# Altium schematic sheet XMC4800-ECAT-P1.SchDoc: XMC4800-ECAT-P1
size A4
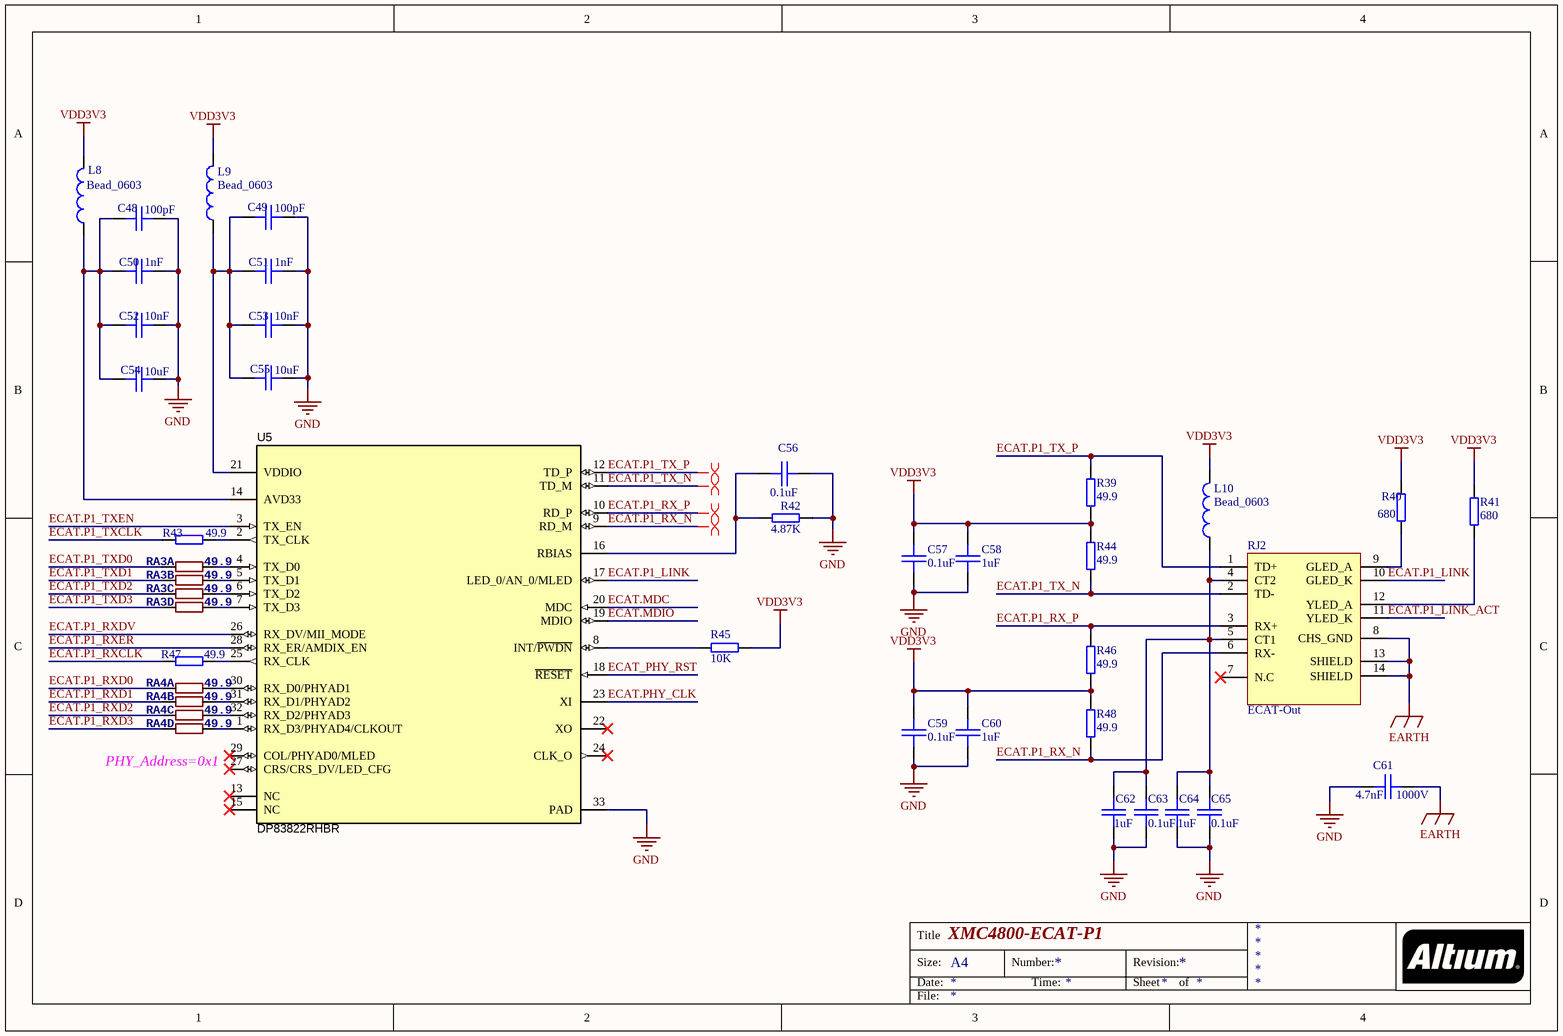
[diagram p0: XMC4800-ECAT-P1.SchDoc]

## Parts
C48  100pF  [CAP-0603]
C49  100pF  [CAP-0603]
C50  1nF  [CAP-0603]
C51  1nF  [CAP-0603]
C52  10nF  [CAP-0603]
C53  10nF  [CAP-0603]
C54  10uF  [CAP-0603]
C55  10uF  [CAP-0603]
C56  0.1uF  [CAP-0603]
C57  0.1uF  [CAP-0603]
C58  1uF  [CAP-0603]
C59  0.1uF  [CAP-0603]
C60  1uF  [CAP-0603]
C61  4.7nF  voltage: 1000V  [CAP-1206]
C62  1uF  [CAP-0603]
C63  0.1uF  [CAP-0603]
C64  1uF  [CAP-0603]
C65  0.1uF  [CAP-0603]
L8  Bead_0603  [L-0603]
L9  Bead_0603  [L-0603]
L10  Bead_0603  [L-0603]
R39  49.9  [RES-0603]
R40  680  [RES-0603]
R41  680  [RES-0603]
R42  4.87K  [RES-0603]
R43  49.9  [RES-0603]
R44  49.9  [RES-0603]
R45  10K  [RES-0603]
R46  49.9  [RES-0603]
R47  49.9  [RES-0603]
R48  49.9  [RES-0603]
RA3  49.9  [LC-0603_Rx4]  (parts A,B,C,D of 4)
RA4  49.9  [LC-0603_Rx4]  (parts A,B,C,D of 4)
RJ2  ECAT-Out  [HR911105A]
U5  DP83822RHBR  [RHB0032B]

## Nets
EARTH: C61.2 RJ2.8(CHS_GND) RJ2.13(SHIELD) RJ2.14(SHIELD)
GND: C48.2 C49.2 C50.1 C51.1 C52.1 C53.1 C54.1 C55.1 C56.2 C57.2 C58.2 C59.2 C60.2 C61.1 C62.2 C63.2 C64.2 C65.2 R42.2 U5.33(PAD)
VDD3V3: C57.1 C58.1 C59.1 C60.1 L8.2 L9.2 L10.2 R39.1 R40.2 R41.1 R44.2 R45.2 R46.1 R48.2
ECAT.MDC: U5.20(MDC)
ECAT.MDIO: U5.19(MDIO)
ECAT.P1_LINK: RJ2.10(GLED_K) U5.17(LED_0/AN_0/MLED)
ECAT.P1_LINK_ACT: RJ2.11(YLED_K)
ECAT.P1_RX_N: R48.1 RJ2.6(RX-) U5.9(RD_M)
ECAT.P1_RX_P: R46.2 RJ2.3(RX+) U5.10(RD_P)
ECAT.P1_RXCLK: R47.1
ECAT.P1_RXD0: RA4.1
ECAT.P1_RXD1: RA4.2
ECAT.P1_RXD2: RA4.3
ECAT.P1_RXD3: RA4.4
ECAT.P1_RXDV: U5.26(RX_DV/MII_MODE)
ECAT.P1_RXER: U5.28(RX_ER/AMDIX_EN)
ECAT.P1_TX_N: R44.1 RJ2.2(TD-) U5.11(TD_M)
ECAT.P1_TX_P: R39.2 RJ2.1(TD+) U5.12(TD_P)
ECAT.P1_TXCLK: R43.1
ECAT.P1_TXD0: RA3.1
ECAT.P1_TXD1: RA3.2
ECAT.P1_TXD2: RA3.3
ECAT.P1_TXD3: RA3.4
ECAT.P1_TXEN: U5.3(TX_EN)
ECAT.PHY_CLK: U5.23(XI)
ECAT_PHY_RST: U5.18(~{RESET})
NetC48_1: C48.1 C50.2 C52.2 C54.2 L8.1 U5.14(AVD33)
NetC49_1: C49.1 C51.2 C53.2 C55.2 L9.1 U5.21(VDDIO)
NetC56_1: C56.1 R42.1 U5.16(RBIAS)
NetC62_1: C62.1 C63.1 C64.1 C65.1 L10.1 RJ2.4(CT2) RJ2.5(CT1)
NetR40_1: R40.1 RJ2.9(GLED_A)
NetR41_2: R41.2 RJ2.12(YLED_A)
NetR43_2: R43.2 U5.2(TX_CLK)
NetR45_1: R45.1 U5.8(INT/~{PWDN})
NetR47_2: R47.2 U5.25(RX_CLK)
NetRA3_5: RA3.5 U5.7(TX_D3)
NetRA3_6: RA3.6 U5.6(TX_D2)
NetRA3_7: RA3.7 U5.5(TX_D1)
NetRA3_8: RA3.8 U5.4(TX_D0)
NetRA4_5: RA4.5 U5.1(RX_D3/PHYAD4/CLKOUT)
NetRA4_6: RA4.6 U5.32(RX_D2/PHYAD3)
NetRA4_7: RA4.7 U5.31(RX_D1/PHYAD2)
NetRA4_8: RA4.8 U5.30(RX_D0/PHYAD1)

Not connected (* = marked no-connect by the designer): RJ2 7(N.C)*; U5 13(NC)* 15(NC)* 22(XO)* 24(CLK_O)* 27(CRS/CRS_DV/LED_CFG)* 29(COL/PHYAD0/MLED)*

## Layout directives
differential pair: ECAT.P1_RX_N, ECAT.P1_RX_P, ECAT.P1_TX_N, ECAT.P1_TX_P

## Notes on the sheet
- (near RA4) PHY_Address=0x1
- Title
- Size:
- Date:
- A4
- Number:
- Time:
- Revision:
- Sheet
- of
- File:

## Library data of the parts
C48-C60 C62-C65 = C_0603: 陶瓷贴片电容0603; tolerance: 10%; voltage: 50V; ESR: 1.73mOhm; IRMS: 5.59A; Series: X7R
  C48 C49: C_value: 100pF
  C50 C51: C_value: 1nF
  C52 C53: C_value: 10nF
  C54 C55: C_value: 10uF
  C56 C57 C59 C63 C65: C_value: 0.1uF
  C58 C60 C62 C64: C_value: 1uF
C61 = C_1206: 陶瓷贴片电容1206; tolerance: 10%; C_value: 4.7nF
L8-L10 = Bead_0603: 贴片磁珠0603; Impedance: 120Ohm; Current: 2A
R39-R48 = R_0603: 贴片电阻0603; tolerance: 5%; voltage: 50V; power: 0.063W
  R39 R43 R44 R46-R48: R_value: 49.9
  R40 R41: R_value: 680
  R42: R_value: 4.87K
  R45: R_value: 10K
RA3 RA4 = RS_ARR4: 排阻; R_Value: 49.9
RJ2 = HR911105A: Output; LatestRevisionDate: 17-Jul-2002; LatestRevisionNote: Re-released for DXP Platform.; Publisher: Altium Limited
U5 = DP83822RHBR: 10/100 Ethernet PHY, RHB0032B; Alternate PartNumber: DP83822RHBT; Manufacturer: Texas Instruments; SymbolCreator: Altium; SizeArea_mm2: 25; SizeAreaWB_mm2: 49; SizeX_mm: 5; SizeZ_mm: 1; CompType: IC; U/M: EA; SymbolVersion: 2016-3-6; PartNumber: DP83822RHBR; PackageReference: RHB0032B; PackageDescription: VQFN-32; MountType: SMT; SizeY_mm: 5; ComponentLink1Description: Datasheet Link; ComponentLink1URL: https://sps06.itg.ti.com/sites/KMS/crossdivteams/altium/docs/ComponentDatasheets/DP83822 Hardware Requirements.docx; RoHS: Y; Publisher: Texas Instruments; LatestRevisionDate: 2016-07-20; Alternate Manufacturer: Texas Instruments